# Altium schematic sheet Level Shifter.SchDoc
size A4; DocumentNumber: 6; SheetNumber: 6; SheetTotal: 8
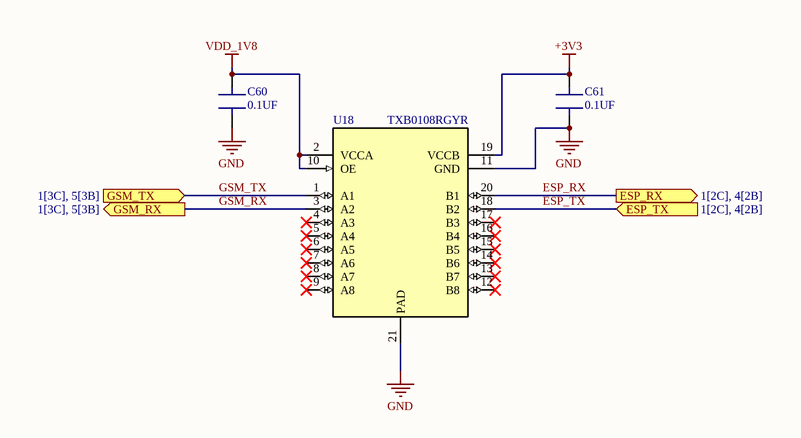
[diagram p0: Level Shifter.SchDoc]

## Parts
C60  0.1UF  [CAP: 0603]
C61  0.1UF  [CAP: 0603]
U18  TXB0108RGYR  [20-VQFN (3.5x4.5)]

## Ports
ESP_RX (out, see 1[2C], 4[2B]), ESP_TX (in, see 1[2C], 4[2B]), GSM_RX (out, see 1[3C], 5[3B]), GSM_TX (in, see 1[3C], 5[3B])

## Nets
+3V3: C61.1(A) U18.19(VCCB)
GND: C60.2(B) C61.2(B) U18.11(GND) U18.21(PAD)
VDD_1V8: C60.1(A) U18.2(VCCA) U18.10(OE)
ESP_RX: U18.20(B1) ; port ESP_RX
ESP_TX: U18.18(B2) ; port ESP_TX
GSM_RX: U18.3(A2) ; port GSM_RX
GSM_TX: U18.1(A1) ; port GSM_TX

Not connected (* = marked no-connect by the designer): U18 4(A3)* 5(A4)* 6(A5)* 7(A6)* 8(A7)* 9(A8)* 12(B8)* 13(B7)* 14(B6)* 15(B5)* 16(B4)* 17(B3)*

## Notes on the sheet
- Size:
- Date:
- Sheet Name:
- A4
- Sheet
- Time:
- of
- Author :
- Hatim Saad
- Project:
- File:

## Library data of the parts
C60 C61 = CAP 0603: CAP SMD 0603
U18 = TXB0108RGYR: IC 8-BIT TRNSLTR 15KV ESD 20VQFN; Manufacturer: Texas Instruments; Supplier 1: Mouser; Manufacturer Part Number: TXB0108RGYR; RoHS: Yes; Category: Voltage Level Shifters; Stock 1: 27868; Pricing 1: 1=1.54, 10=1.32, 50=1.32, 100=1.12, 1000=0.763, 10000=0.671 (USD); ComponentLink1URL: https://datasheet.ciiva.com/15096/getdatasheetpartid-172984-15096214.pdf?src-supplier=Verical; ComponentLink1Description: https://datasheet.ciiva.com/15096/getdatasheetpartid-172984-15096214.pdf?src-supplier=Verical; ComponentLink2URL: https://datasheet.ciiva.com/1899/txb0108-1899601.pdf?src-supplier=Digi-Key; ComponentLink2Description: https://datasheet.ciiva.com/1899/txb0108-1899601.pdf?src-supplier=Digi-Key; ComponentLink3URL: https://datasheet.ciiva.com/1899/txb0108-1899602.pdf?src-supplier=Digi-Key; ComponentLink3Description: https://datasheet.ciiva.com/1899/txb0108-1899602.pdf?src-supplier=Digi-Key; ComponentLink4URL: https://datasheet.ciiva.com/1899/txb0108-1899603.pdf?src-supplier=Digi-Key; ComponentLink4Description: https://datasheet.ciiva.com/1899/txb0108-1899603.pdf?src-supplier=Digi-Key; ComponentLink5URL: https://datasheet.ciiva.com/1508/1811182-1508728.pdf?src-supplier=Element14; ComponentLink5Description: https://datasheet.ciiva.com/1508/1811182-1508728.pdf?src-supplier=Element14; Supplier Part Number 1: 595-TXB0108RGYR